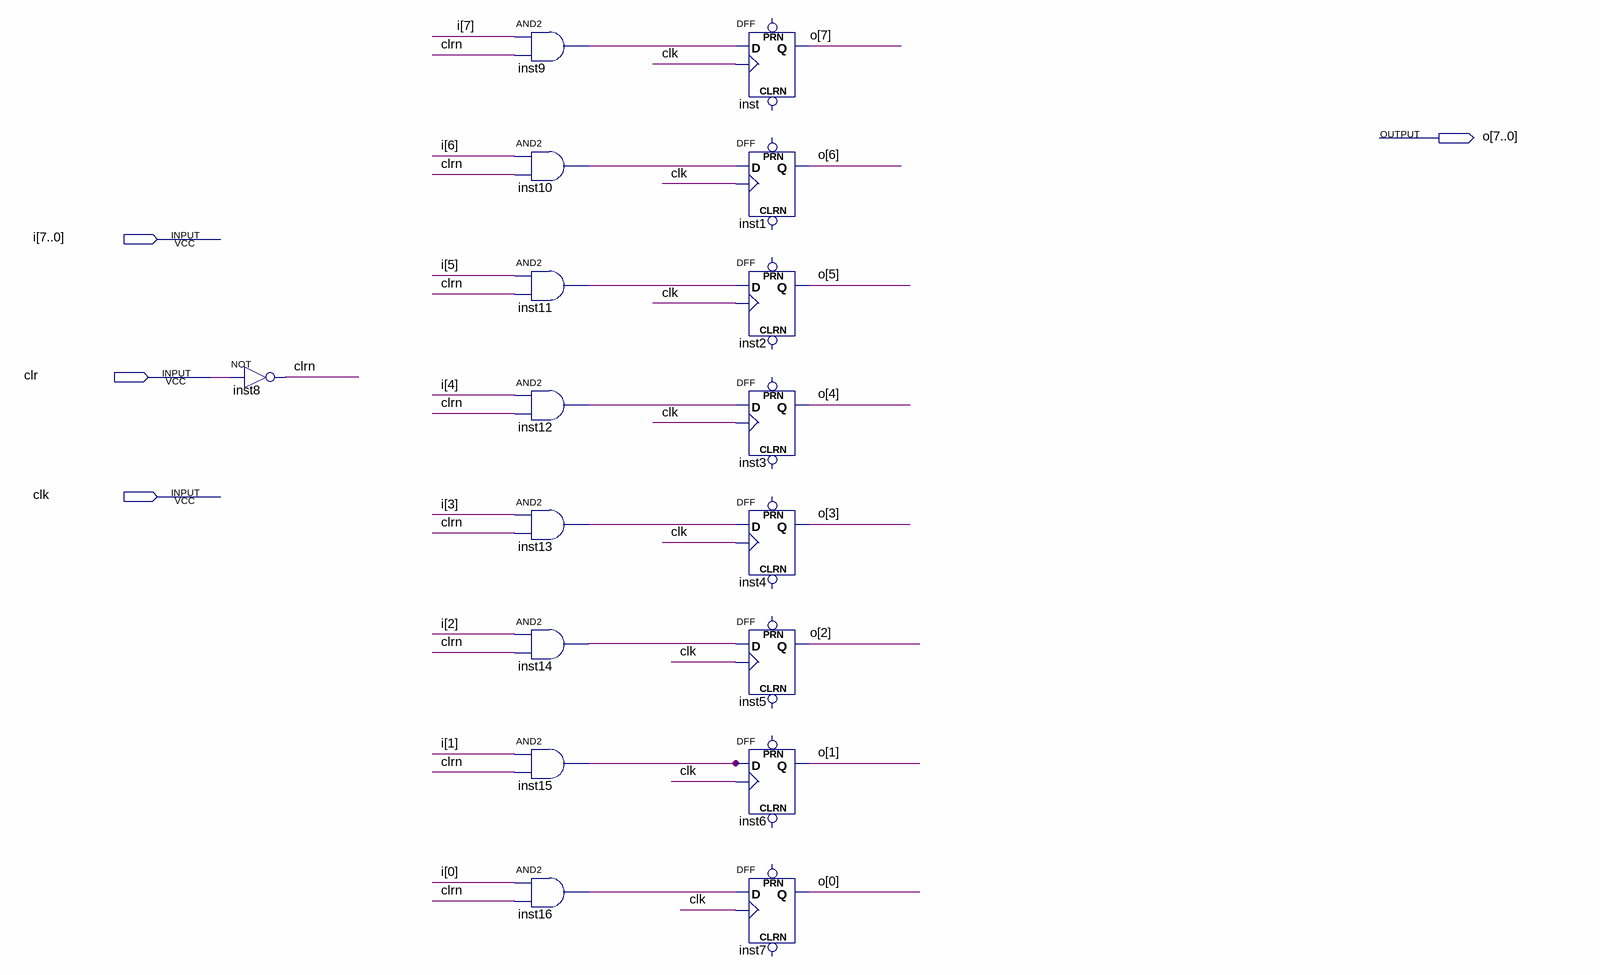
[diagram p0: schematic sheet]
// Quartus schematic Register8.bdf as structural Verilog: 17 symbols, 4 pins
module Register8 (
  input  [7:0] i,
  input  clr,
  input  clk,
  output [7:0] o
);

  wire clrn, inst9_out, inst10_out, inst11_out, inst12_out, inst13_out, inst14_out, inst15_out, inst16_out;

  not inst8 (clrn, clr);
  and inst9 (inst9_out, i[7], clrn);
  and inst10 (inst10_out, i[6], clrn);
  and inst11 (inst11_out, i[5], clrn);
  and inst12 (inst12_out, i[4], clrn);
  and inst13 (inst13_out, i[3], clrn);
  and inst14 (inst14_out, i[2], clrn);
  and inst15 (inst15_out, i[1], clrn);
  and inst16 (inst16_out, i[0], clrn);
  DFF inst (.CLK(clk), .D(inst9_out), .Q(o[7]));  // open: CLRN, PRN
  DFF inst1 (.CLK(clk), .D(inst10_out), .Q(o[6]));  // open: CLRN, PRN
  DFF inst2 (.CLK(clk), .D(inst11_out), .Q(o[5]));  // open: CLRN, PRN
  DFF inst3 (.CLK(clk), .D(inst12_out), .Q(o[4]));  // open: CLRN, PRN
  DFF inst4 (.CLK(clk), .D(inst13_out), .Q(o[3]));  // open: CLRN, PRN
  DFF inst5 (.CLK(clk), .D(inst14_out), .Q(o[2]));  // open: CLRN, PRN
  DFF inst6 (.CLK(clk), .D(inst15_out), .Q(o[1]));  // open: CLRN, PRN
  DFF inst7 (.CLK(clk), .D(inst16_out), .Q(o[0]));  // open: CLRN, PRN
endmodule
